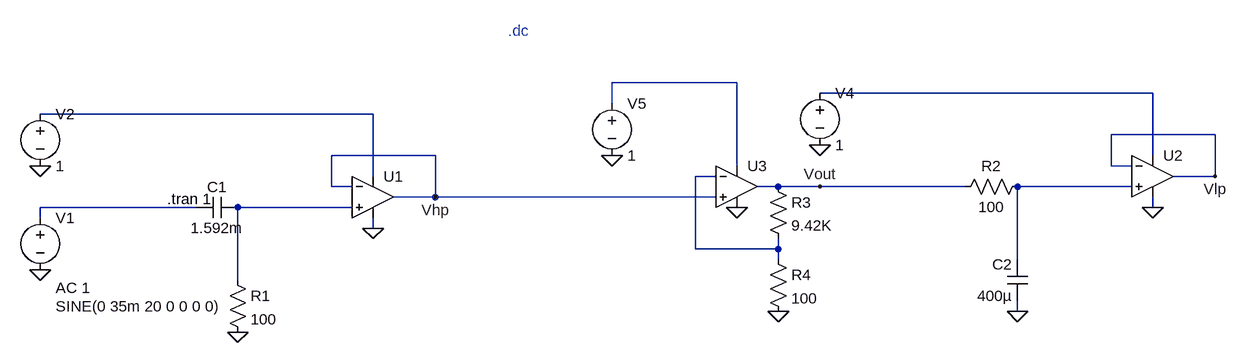
[diagram p0: schematic Cascaded_Filter.asc]
Cascaded_Filter.asc, the LTspice schematic file:
Version 4
SHEET 1 2308 884
WIRE 880 -144 688 -144
WIRE 1520 -128 1008 -128
WIRE 688 -112 688 -144
WIRE 320 -96 -192 -96
WIRE 1616 -64 1456 -64
WIRE 416 -32 256 -32
WIRE 1520 -32 1520 -128
WIRE 880 -16 880 -144
WIRE 1456 -16 1456 -64
WIRE 1488 -16 1456 -16
WIRE 320 0 320 -96
WIRE 848 0 816 0
WIRE 1616 0 1616 -64
WIRE 1616 0 1552 0
WIRE 256 16 256 -32
WIRE 288 16 256 16
WIRE 944 16 912 16
WIRE 1008 16 944 16
WIRE 1232 16 1008 16
WIRE 1488 16 1312 16
WIRE 416 32 416 -32
WIRE 416 32 352 32
WIRE 848 32 416 32
WIRE 48 48 -192 48
WIRE 288 48 112 48
WIRE 1520 48 1520 32
WIRE -192 64 -192 48
WIRE 320 80 320 64
WIRE 816 112 816 0
WIRE 944 112 944 96
WIRE 944 112 816 112
WIRE 944 128 944 112
WIRE 1312 128 1312 16
WIRE 112 160 112 48
WIRE 1312 208 1312 192
FLAG -192 144 0
FLAG 112 240 0
FLAG -192 -16 0
FLAG 320 80 0
FLAG 416 32 Vhp
FLAG 1312 208 0
FLAG 1008 -48 0
FLAG 1520 48 0
FLAG 1616 0 Vlp
FLAG 880 48 0
FLAG 688 -32 0
FLAG 944 208 0
FLAG 1008 16 Vout
SYMBOL cap 112 32 R90
WINDOW 0 0 32 VBottom 2
WINDOW 3 32 32 VTop 2
SYMATTR InstName C1
SYMATTR Value 1.592m
SYMBOL res 96 144 R0
SYMATTR InstName R1
SYMATTR Value 100
SYMBOL voltage -192 48 R0
WINDOW 123 24 124 Left 2
WINDOW 39 0 0 Left 0
WINDOW 3 24 152 Left 2
SYMATTR Value2 AC 1
SYMATTR InstName V1
SYMATTR Value SINE(0 35m 20 0 0 0 0)
SYMBOL OpAmps\\UniversalOpAmp 320 32 R0
SYMATTR InstName U1
SYMBOL voltage -192 -112 R0
WINDOW 123 0 0 Left 0
WINDOW 39 0 0 Left 0
SYMATTR InstName V2
SYMATTR Value 1
SYMBOL cap 1328 192 R180
WINDOW 0 24 56 Left 2
WINDOW 3 24 8 Left 2
SYMATTR InstName C2
SYMATTR Value 400µ
SYMBOL res 1328 0 R90
WINDOW 0 0 56 VBottom 2
WINDOW 3 32 56 VTop 2
SYMATTR InstName R2
SYMATTR Value 100
SYMBOL OpAmps\\UniversalOpAmp 1520 0 R0
SYMATTR InstName U2
SYMBOL voltage 1008 -144 R0
WINDOW 123 0 0 Left 0
WINDOW 39 0 0 Left 0
SYMATTR InstName V4
SYMATTR Value 1
SYMBOL OpAmps\\UniversalOpAmp 880 16 R0
SYMATTR InstName U3
SYMBOL voltage 688 -128 R0
WINDOW 123 0 0 Left 0
WINDOW 39 0 0 Left 0
SYMATTR InstName V5
SYMATTR Value 1
SYMBOL res 928 0 R0
SYMATTR InstName R3
SYMATTR Value 9.42K
SYMBOL res 928 112 R0
SYMATTR InstName R4
SYMATTR Value 100
TEXT 528 -224 Left 2 ;.dc
TEXT 3 35 Left 2 !.tran 1

The netlist it stands for:
* Cascaded_Filter.asc
C1 N007 N006 1.592m
R1 N007 0 100
V1 N006 0 SINE(0 35m 20 0 0 0 0) AC 1
XU1 N007 Vhp N003 0 Vhp level1 Avol=1Meg GBW=10Meg Vos=0 En=0 Enk=0 In=0 Ink=0 Rin=500Meg  ; pins In+ In- V+ V- OUT
V2 N003 0 1
C2 0 N005 400µ
R2 N005 Vout 100
XU2 N005 Vlp N002 0 Vlp level1 Avol=1Meg GBW=10Meg Vos=0 En=0 Enk=0 In=0 Ink=0 Rin=500Meg  ; pins In+ In- V+ V- OUT
V4 N002 0 1
XU3 Vhp N004 N001 0 Vout level1 Avol=1Meg GBW=10Meg Vos=0 En=0 Enk=0 In=0 Ink=0 Rin=500Meg  ; pins In+ In- V+ V- OUT
V5 N001 0 1
R3 Vout N004 9.42K
R4 N004 0 100
* .dc
.tran 1
.lib UniversalOpAmp1.lib
.backanno
.end